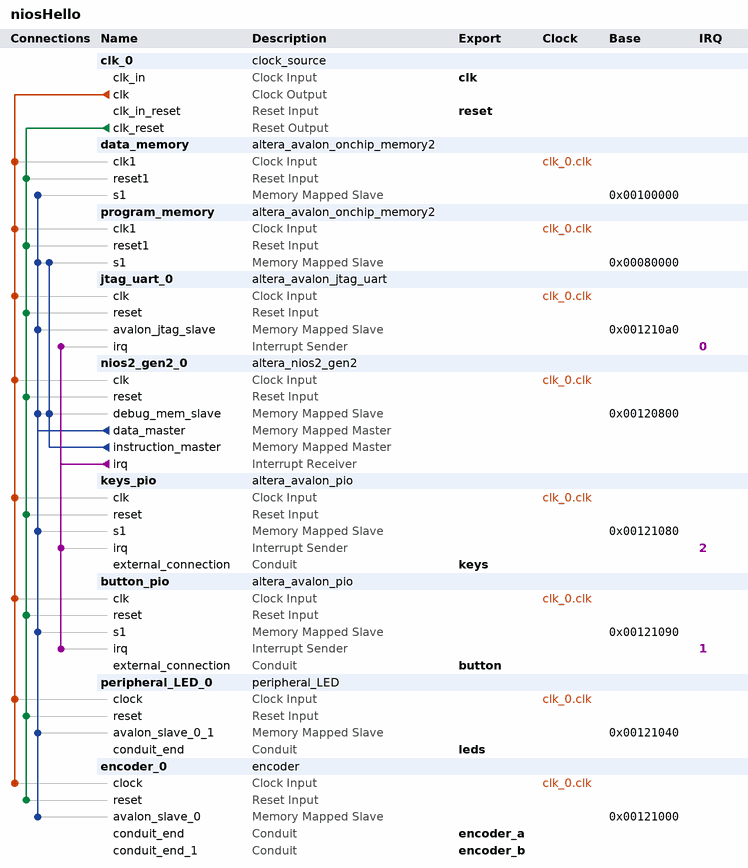
[diagram p0: system contents]
# Platform Designer (Qsys) system niosHello, Cyclone V 5CSEBA6U23I7
# Parameters at their usual value, and those the tool derives, are not listed.
package require -exact qsys 18.0
create_system niosHello
set_project_property DEVICE_FAMILY {Cyclone V}
set_project_property DEVICE 5CSEBA6U23I7

add_instance clk_0 clock_source 18.0
set_instance_parameter_value clk_0 clockFrequency 50000000

add_instance data_memory altera_avalon_onchip_memory2 18.0
set_instance_parameter_value data_memory dataWidth 32
set_instance_parameter_value data_memory dualPort false
set_instance_parameter_value data_memory initMemContent true
set_instance_parameter_value data_memory initializationFileName onchip_mem.hex
set_instance_parameter_value data_memory memorySize 92768

add_instance program_memory altera_avalon_onchip_memory2 18.0
set_instance_parameter_value program_memory dataWidth 32
set_instance_parameter_value program_memory dualPort false
set_instance_parameter_value program_memory initMemContent true
set_instance_parameter_value program_memory initializationFileName onchip_mem.hex
set_instance_parameter_value program_memory memorySize 264768

add_instance jtag_uart_0 altera_avalon_jtag_uart 18.0
set_instance_parameter_value jtag_uart_0 simInteractiveOptions NO_INTERACTIVE_WINDOWS

add_instance nios2_gen2_0 altera_nios2_gen2 18.0
set_instance_parameter_value nios2_gen2_0 dcache_size 2048
set_instance_parameter_value nios2_gen2_0 exceptionSlave program_memory.s1
set_instance_parameter_value nios2_gen2_0 icache_size 4096
set_instance_parameter_value nios2_gen2_0 impl Tiny
set_instance_parameter_value nios2_gen2_0 resetSlave program_memory.s1

add_instance keys_pio altera_avalon_pio 18.0
set_instance_parameter_value keys_pio captureEdge true
set_instance_parameter_value keys_pio direction Input
set_instance_parameter_value keys_pio edgeType ANY
set_instance_parameter_value keys_pio generateIRQ true
set_instance_parameter_value keys_pio irqType EDGE
set_instance_parameter_value keys_pio width 4

add_instance button_pio altera_avalon_pio 18.0
set_instance_parameter_value button_pio captureEdge true
set_instance_parameter_value button_pio direction Input
set_instance_parameter_value button_pio edgeType ANY
set_instance_parameter_value button_pio generateIRQ true
set_instance_parameter_value button_pio irqType EDGE
set_instance_parameter_value button_pio width 1

add_instance peripheral_LED_0 peripheral_LED 1.0
set_instance_parameter_value peripheral_LED_0 LEN 6

add_instance encoder_0 encoder 1.0

# connections
add_connection clk_0.clk button_pio.clk clock
add_connection clk_0.clk data_memory.clk1 clock
add_connection clk_0.clk encoder_0.clock clock
add_connection clk_0.clk jtag_uart_0.clk clock
add_connection clk_0.clk keys_pio.clk clock
add_connection clk_0.clk nios2_gen2_0.clk clock
add_connection clk_0.clk peripheral_LED_0.clock clock
add_connection clk_0.clk program_memory.clk1 clock
add_connection clk_0.clk_reset button_pio.reset reset
add_connection clk_0.clk_reset data_memory.reset1 reset
add_connection clk_0.clk_reset encoder_0.reset reset
add_connection clk_0.clk_reset jtag_uart_0.reset reset
add_connection clk_0.clk_reset keys_pio.reset reset
add_connection clk_0.clk_reset nios2_gen2_0.reset reset
add_connection clk_0.clk_reset peripheral_LED_0.reset reset
add_connection clk_0.clk_reset program_memory.reset1 reset
add_connection nios2_gen2_0.data_master button_pio.s1 avalon
set_connection_parameter_value nios2_gen2_0.data_master/button_pio.s1 baseAddress 0x00121090
add_connection nios2_gen2_0.data_master data_memory.s1 avalon
set_connection_parameter_value nios2_gen2_0.data_master/data_memory.s1 baseAddress 0x00100000
add_connection nios2_gen2_0.data_master encoder_0.avalon_slave_0 avalon
set_connection_parameter_value nios2_gen2_0.data_master/encoder_0.avalon_slave_0 baseAddress 0x00121000
add_connection nios2_gen2_0.data_master jtag_uart_0.avalon_jtag_slave avalon
set_connection_parameter_value nios2_gen2_0.data_master/jtag_uart_0.avalon_jtag_slave baseAddress 0x001210a0
add_connection nios2_gen2_0.data_master keys_pio.s1 avalon
set_connection_parameter_value nios2_gen2_0.data_master/keys_pio.s1 baseAddress 0x00121080
add_connection nios2_gen2_0.data_master nios2_gen2_0.debug_mem_slave avalon
set_connection_parameter_value nios2_gen2_0.data_master/nios2_gen2_0.debug_mem_slave baseAddress 0x00120800
add_connection nios2_gen2_0.data_master peripheral_LED_0.avalon_slave_0_1 avalon
set_connection_parameter_value nios2_gen2_0.data_master/peripheral_LED_0.avalon_slave_0_1 baseAddress 0x00121040
add_connection nios2_gen2_0.data_master program_memory.s1 avalon
set_connection_parameter_value nios2_gen2_0.data_master/program_memory.s1 baseAddress 0x00080000
add_connection nios2_gen2_0.instruction_master nios2_gen2_0.debug_mem_slave avalon
set_connection_parameter_value nios2_gen2_0.instruction_master/nios2_gen2_0.debug_mem_slave baseAddress 0x00120800
add_connection nios2_gen2_0.instruction_master program_memory.s1 avalon
set_connection_parameter_value nios2_gen2_0.instruction_master/program_memory.s1 baseAddress 0x00080000
add_connection nios2_gen2_0.irq button_pio.irq interrupt
set_connection_parameter_value nios2_gen2_0.irq/button_pio.irq irqNumber 1
add_connection nios2_gen2_0.irq jtag_uart_0.irq interrupt
set_connection_parameter_value nios2_gen2_0.irq/jtag_uart_0.irq irqNumber 0
add_connection nios2_gen2_0.irq keys_pio.irq interrupt
set_connection_parameter_value nios2_gen2_0.irq/keys_pio.irq irqNumber 2

# exported interfaces
add_interface button conduit end
set_interface_property button EXPORT_OF button_pio.external_connection
add_interface clk clock sink
set_interface_property clk EXPORT_OF clk_0.clk_in
add_interface encoder_a conduit end
set_interface_property encoder_a EXPORT_OF encoder_0.conduit_end
add_interface encoder_b conduit end
set_interface_property encoder_b EXPORT_OF encoder_0.conduit_end_1
add_interface keys conduit end
set_interface_property keys EXPORT_OF keys_pio.external_connection
add_interface leds conduit end
set_interface_property leds EXPORT_OF peripheral_LED_0.conduit_end
add_interface reset reset sink
set_interface_property reset EXPORT_OF clk_0.clk_in_reset

set_interconnect_requirement {$system} qsys_mm.clockCrossingAdapter HANDSHAKE
set_interconnect_requirement {$system} qsys_mm.enableEccProtection FALSE
set_interconnect_requirement {$system} qsys_mm.insertDefaultSlave FALSE
set_interconnect_requirement {$system} qsys_mm.maxAdditionalLatency 1

save_system niosHello.qsys
